# EAGLE schematic HomeAutomation (EAGLE 9.6.2)
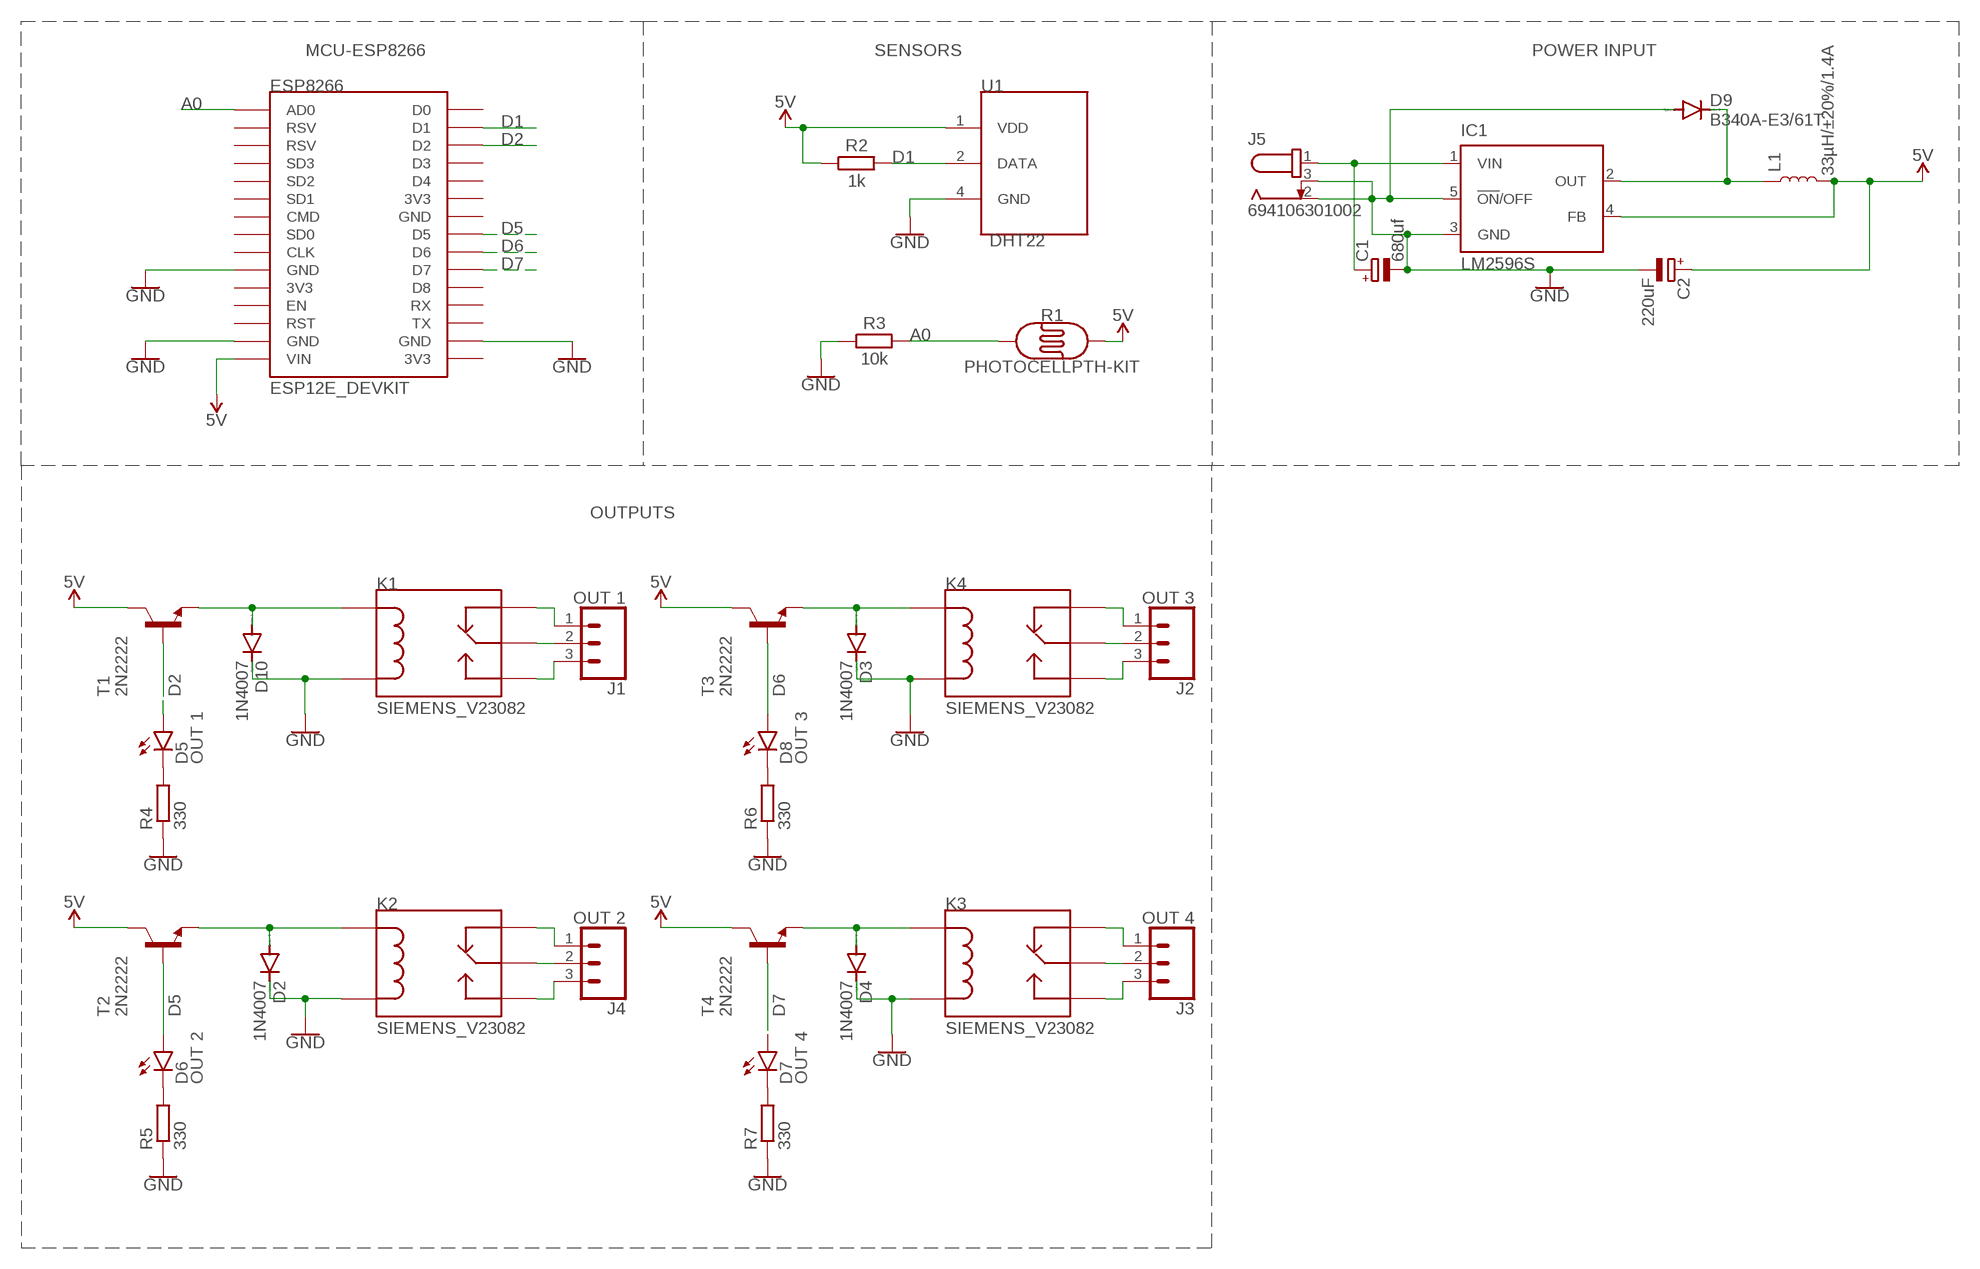
[diagram p0: schematic, sheet 1]

## Parts
C1  680uf  CPOL-EU153CLV-0405  [153CLV-0405]
C2  220uF  CPOL-EU153CLV-0405  [153CLV-0405]
D2  1N4007  DIODE-DO214AC  [DO214AC]
D3  1N4007  DIODE-DO214AC  [DO214AC]
D4  1N4007  DIODE-DO214AC  [DO214AC]
D5  OUT 1  LEDCHIPLED_1206  [CHIPLED_1206]
D6  OUT 2  LEDCHIPLED_1206  [CHIPLED_1206]
D7  OUT 4  LEDCHIPLED_1206  [CHIPLED_1206]
D8  OUT 3  LEDCHIPLED_1206  [CHIPLED_1206]
D9  B340A-E3/61T  DIODE-DO214AC  [DO214AC]
D10  1N4007  DIODE-DO214AC  [DO214AC]
ESP8266  ESP12E_DEVKIT  [ESP12E_DEVKIT]
IC1  LM2596S  [TO263-5]
J1  OUT 1  CONN_03-SCREW-5MM  [SCREWTERMINAL-5MM-3]
J2  OUT 3  CONN_03-SCREW-5MM  [SCREWTERMINAL-5MM-3]
J3  OUT 4  CONN_03-SCREW-5MM  [SCREWTERMINAL-5MM-3]
J4  OUT 2  CONN_03-SCREW-5MM  [SCREWTERMINAL-5MM-3]
J5  694106301002  [694106301002]
K1  SIEMENS_V23082  SIEMENS_V23082_RELAY  [SIEMENS_V23082_RELAY]
K2  SIEMENS_V23082  SIEMENS_V23082_RELAY  [SIEMENS_V23082_RELAY]
K3  SIEMENS_V23082  SIEMENS_V23082_RELAY  [SIEMENS_V23082_RELAY]
K4  SIEMENS_V23082  SIEMENS_V23082_RELAY  [SIEMENS_V23082_RELAY]
L1  33µH/±20%/1.4A  INDUCTOR-SRN6045-33UH  [SRN6045]
R1  PHOTOCELLPTH-KIT  [PHOTOCELL-KIT]
R2  1k  R_CHIP-0402(1005-METRIC)  [RESC1005X40]
R3  10k  R_CHIP-0402(1005-METRIC)  [RESC1005X40]
R4  330  R-EU_R0805  [R0805]
R5  330  R-EU_R0805  [R0805]
R6  330  R-EU_R0805  [R0805]
R7  330  R-EU_R0805  [R0805]
T1  2N2222  MMBT2222ALT1-NPN-SOT23-BEC  [SOT23-BEC]
T2  2N2222  MMBT2222ALT1-NPN-SOT23-BEC  [SOT23-BEC]
T3  2N2222  MMBT2222ALT1-NPN-SOT23-BEC  [SOT23-BEC]
T4  2N2222  MMBT2222ALT1-NPN-SOT23-BEC  [SOT23-BEC]
U1  DHT22  [DHT22]

## Nets
5V: C2.+ ESP8266.VIN IC1.4(FB) L1.2 R1.2 R2.1 T1.C T2.C T3.C T4.C U1.1(VDD)
A0: ESP8266.AD0 R1.1 R3.2
D1: ESP8266.D1 R2.2 U1.2(DATA)
D2: D5.A ESP8266.D2 T1.B
D5: D6.A ESP8266.D5 T2.B
D6: D8.A ESP8266.D6 T3.B
D7: D7.A ESP8266.D7 T4.B
GND: C1.- C2.- D2.C D3.C D4.C D9.A D10.C ESP8266.GND@0(GND) ESP8266.GND@1(GND) ESP8266.GND@3(GND) IC1.3(GND) IC1.5(!ON!/OFF) J5.2 J5.3 K1.P$2 K2.P$2 K3.P$2 K4.P$2 R3.1 R4.1 R5.1 R6.1 R7.1 U1.4(GND)
N$1: D10.A K1.P$1 T1.E
N$2: J2.1 K4.P$5
N$3: D2.A K2.P$1 T2.E
N$4: J2.2 K4.P$3
N$5: D3.A K4.P$1 T3.E
N$6: J2.3 K4.P$4
N$7: J3.1 K3.P$5
N$9: J3.2 K3.P$3
N$10: J3.3 K3.P$4
N$11: J4.1 K2.P$5
N$12: J4.2 K2.P$3
N$13: J4.3 K2.P$4
N$14: J1.3 K1.P$4
N$15: J1.2 K1.P$3
N$16: J1.1 K1.P$5
N$17: D5.C R4.2
N$18: D6.C R5.2
N$19: C1.+ IC1.1(VIN) J5.1
N$20: D8.C R6.2
N$21: D7.C R7.2
N$23: D9.C IC1.2(OUT) L1.1
N$26: D4.A K3.P$1 T4.E
Unconnected: ESP8266.3V3@0(3V3) ESP8266.3V3@1(3V3) ESP8266.3V3@2(3V3) ESP8266.CLK ESP8266.CMD ESP8266.D0 ESP8266.D3 ESP8266.D4 ESP8266.D8 ESP8266.EN ESP8266.GND@2(GND) ESP8266.RST ESP8266.RSV@0(RSV) ESP8266.RSV@1(RSV) ESP8266.RX ESP8266.SD0 ESP8266.SD1 ESP8266.SD2 ESP8266.SD3 ESP8266.TX

## Notes on the sheet
- MCU-ESP8266 | SENSORS | POWER INPUT
- OUTPUTS

## Library data of the parts
C1 C2 = rcl:CPOL-EU: POLARIZED CAPACITOR, European symbol; SPICEPREFIX: C
D2-D4 D9 D10 = diode:DIODE-: DIODE
D5-D8 = led:LED: LED OSRAM: - CHIPLED LG R971, LG N971, LY N971, LG Q971, LY Q971, LO R971, LY R971 LH N974, LH R974 LS Q976, LO Q976, LY Q976 LO Q996 - Hyper CHIPLED LW Q18S LB Q993, LB Q99A, LB R99A - SideLED LS A670, LO A670, LY A670, LG A670, LP A670 LB A673, LV A673, LT A673, LW A673 LH A674 LY A675 LS A676, LA A676, LO A676, LY A676, LW A676 LS A679, LY A679, LG A679 - Hyper Micro SIDELED® LS Y876, LA Y876, LO Y876, LY Y876 LT Y87S - SmartLED LW L88C, LW L88S LB L89C, LB L89S, LG L890 LS L89K, LO L89K, LY L89K LS L896, LA L896, LO L896, LY L896 - TOPLED LS T670, LO T670, LY T670, LG T670, LP T670 LSG T670, LSP T670, LSY T670, LOP T670, LYG T670 LG T671, LOG T671, LSG T671 LB T673, LV T673, LT T673, LW T673 LH T674 LS T676, LA T676, LO T676, LY T676, LB T676, LH T676, LSB T676, LW T676 LB T67C, LV T67C, LT T67C, LS T67K, LO T67K, LY T67K, LW E67C LS E67B, LA E67B, LO E67B, LY E67B, LB E67C, LV E67C, LT E67C LW T67C LS T679, LY T679, LG T679 LS T770, LO T770, LY T770, LG T770, LP T770 LB T773, LV T773, LT T773, LW T773 LH T774 LS E675, LA E675, LY E675, LS T675 LS T776, LA T776, LO T776, LY T776, LB T776 LHGB T686 LT T68C, LB T68C - Hyper Mini TOPLED® LB M676 - Mini TOPLED Santana® LG M470 LS M47K, LO M47K, LY M47K Source: http://www.osram.convergy.de LUXEON: - LUMILED® LXK2-PW12-R00, LXK2-PW12-S00, LXK2-PW14-U00, LXK2-PW14-V00 LXK2-PM12-R00, LXK2-PM12-S00, LXK2-PM14-U00 LXK2-PE12-Q00, LXK2-PE12-R00, LXK2-PE12-S00, LXK2-PE14-T00, LXK2-PE14-U00 LXK2-PB12-K00, LXK2-PB12-L00, LXK2-PB12-M00, LXK2-PB14-N00, LXK2-PB14-P00, LXK2-PB14-Q00 LXK2-PR12-L00, LXK2-PR12-M00, LXK2-PR14-Q00, LXK2-PR14-R00 LXK2-PD12-Q00, LXK2-PD12-R00, LXK2-PD12-S00 LXK2-PH12-R00, LXK2-PH12-S00 LXK2-PL12-P00, LXK2-PL12-Q00, LXK2-PL12-R00 Source: www.luxeon.com KINGBRIGHT: KA-3528ASYC Source: www.kingbright.com
ESP8266 = esp8266:ESP12E_DEVKIT: ESP12E DEVKIT BOARD
IC1 = national-semiconductor:LM2596: SIMPLE SWITCHER® Power Converter 150 kHz 3A Step-Down Voltage Regulator Source: http://www.national.com/ds/LM/LM2596.pdf; MF: NATIONAL SEMICONDUCTOR; MPN: LM2596S-ADJ/NOPB; OC_FARNELL: 9494367; OC_NEWARK: 41K3842
J1-J4 = SparkFun-Connectors:CONN_03: Multi connection point. Often used as Generic Header-pin footprint for 0.1 inch spaced/style header connections On any of the 0.1 inch spaced packages, you can populate with these: Break Away Headers - Straight <https://www.sparkfun.com/products/116> (PRT-00116) Break Away Male Headers - Right Angle <https://www.sparkfun.com/products/553> (PRT-00553) Female Headers <https://www.sparkfun.com/products/115> (PRT-00115) Break Away Headers - Machine Pin <https://www.sparkfun.com/products/117> (PRT-00117) Break Away Female Headers - Swiss Machine Pin <https://www.sparkfun.com/products/743> (PRT-00743) Stackable Header - 3 Pin (Female, 0.1") <https://www.sparkfun.com/products/13875> (PRT-13875) For SCREWTERMINALS and SPRING TERMINALS visit here: Screw Terimnals on SparkFun.com <https://www.sparkfun.com/search/results?term=Screw+Terminals> (5mm/3.5mm/2.54mm spacing) This device is also useful as a general connection point to wire up your design to another part of your project. Our various solder wires solder well into these plated through hole pads. Hook-Up Wire - Assortment (Stranded, 22 AWG) <https://www.sparkfun.com/products/11375> (PRT-11375) Hook-Up Wire - Assortment (Solid Core, 22 AWG) <https://www.sparkfun.com/products/11367> (PRT-11367) View the entire wire category on our website here <https://www.sparkfun.com/categories/141> Special notes: Molex polarized connector foot print use with SKU : PRT-08232 with associated crimp pins and housings.; PROD_ID: CONN-10134; SF_SKU: PRT-08433
J5 = DC Power Jacks:694106301002: CONN PWR JACK 2.1X5.5MM SOLDER Manufacturer's datasheet <https://katalog.we-online.de/em/datasheet/6941xx301002.pdf>; CREATED_BY: PCBLayout.com; DIGIKEY_PART_NUMBER: 732-5930-ND; MANUFACTURER: Wurth Electronics Inc.; MPN: 694106301002
K1-K4 = LezzetliRobotTarifleri:SIEMENS_V23082_RELAY: SIEMENS V23082 3V relay DataSheet: Click Here <https://z3d9b7u8.stackpathcdn.com/pdf-down/V/2/3/V23082-Siemens.pdf>
L1 = SparkFun-Coils:INDUCTOR: Inductors Resist changes in electrical current. Basically a coil of wire. SparkFun Products: SparkFun Load Cell Amplifier - HX711 <https://www.sparkfun.com/products/13879> IOIO-OTG - V2.2 <https://www.sparkfun.com/products/13613>; PROD_ID: NDUC-11627
R1 = SparkFun-Sensors:PHOTOCELL: Photocell (Photodetector, Photo Resistor, CdS) This is a very small light sensor. A photocell changes (also called a photodetector, photo resistor, CdS or photoconductive cell) resistance depending on the amount of light it is exposed to. These little sensors make great ambient light triggers (when light in the room turns on, do something). Datasheet <http://cdn.sparkfun.com/datasheets/Sensors/LightImaging/SEN-09088.pdf> SparkFun Products Mini Photocell <https://www.sparkfun.com/products/9088> (SEN-09088); PROD_ID: COMP-09129; SF_ID: SEN-09088
R2 R3 = Resistor:R: Resistor Fixed - Generic; CATEGORY: Resistor; SUB-CATEGORY: Fixed
R4-R7 = rcl:R-EU_: RESISTOR, European symbol; SPICEPREFIX: R
T1-T4 = transistor:*-NPN-: NPN Transistror BF959 corrected 2008.03.06
U1 = LezzetliRobotTarifleri:DHT22